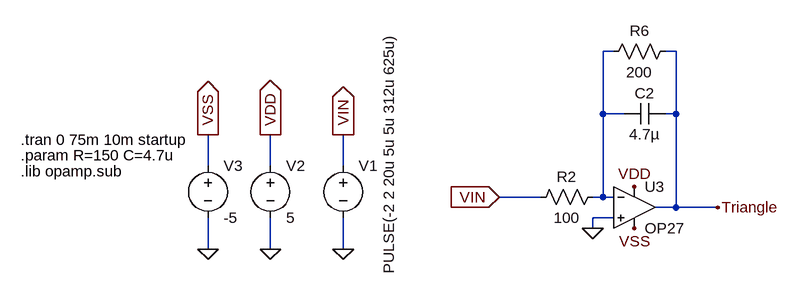
[diagram p0: schematic Integrator.asc]
Integrator.asc, the LTspice schematic file:
Version 4
SHEET 1 880 680
WIRE -16 -640 -32 -640
WIRE 80 -640 64 -640
WIRE -32 -544 -32 -640
WIRE 0 -544 -32 -544
WIRE 80 -544 80 -640
WIRE 80 -544 64 -544
WIRE -640 -464 -640 -512
WIRE -544 -464 -544 -512
WIRE -432 -464 -432 -512
WIRE -128 -416 -192 -416
WIRE -32 -416 -32 -544
WIRE -32 -416 -48 -416
WIRE -16 -416 -32 -416
WIRE 80 -400 80 -544
WIRE 80 -400 48 -400
WIRE 144 -400 80 -400
WIRE -16 -384 -48 -384
WIRE -48 -368 -48 -384
WIRE -640 -336 -640 -384
WIRE -544 -336 -544 -384
WIRE -432 -336 -432 -384
FLAG -48 -368 0
FLAG 144 -400 Triangle
FLAG -544 -336 0
FLAG -544 -512 VDD
IOPIN -544 -512 Out
FLAG -640 -336 0
FLAG -640 -512 VSS
IOPIN -640 -512 Out
FLAG 16 -432 VDD
FLAG 16 -368 VSS
FLAG -432 -336 0
FLAG -432 -512 VIN
IOPIN -432 -512 Out
FLAG -192 -416 VIN
IOPIN -192 -416 In
SYMBOL res -32 -432 R90
WINDOW 0 0 56 VBottom 2
WINDOW 3 32 56 VTop 2
SYMATTR InstName R2
SYMATTR Value 100
SYMBOL cap 64 -560 R90
WINDOW 0 0 32 VBottom 2
WINDOW 3 32 32 VTop 2
SYMATTR InstName C2
SYMATTR Value 4.7µ
SYMBOL Opamps\\OP27 16 -464 R0
SYMATTR InstName U3
SYMBOL voltage -544 -480 R0
SYMATTR InstName V2
SYMATTR Value 5
SYMBOL voltage -640 -480 R0
SYMATTR InstName V3
SYMATTR Value -5
SYMBOL res 80 -656 R90
WINDOW 0 0 56 VBottom 2
WINDOW 3 32 56 VTop 2
SYMATTR InstName R6
SYMATTR Value 200
SYMBOL voltage -432 -480 R0
WINDOW 3 70 -190 VRight 2
WINDOW 123 0 0 Left 2
WINDOW 39 0 0 Left 2
SYMATTR InstName V1
SYMATTR Value PULSE(-2 2 20u 5u 5u 312u 625u)
TEXT -928 -456 Left 2 !.lib opamp.sub
TEXT -928 -504 Left 2 !.tran 0 75m 10m startup
TEXT -928 -480 Left 2 !.param R=150 C=4.7u

The netlist it stands for:
* Integrator.asc
R2 N001 VIN 100
C2 Triangle N001 4.7µ
XU3 0 N001 VDD VSS Triangle OP27  ; pins In+ In- V+ V- OUT
V2 VDD 0 5
V3 VSS 0 -5
R6 Triangle N001 200
V1 VIN 0 PULSE(-2 2 20u 5u 5u 312u 625u)
.lib opamp.sub
.tran 0 75m 10m startup
.param R=150 C=4.7u
.lib ADI.lib
.backanno
.end